# Altium project Audio-Beamformer.PrjPcb (part 1 of 2)
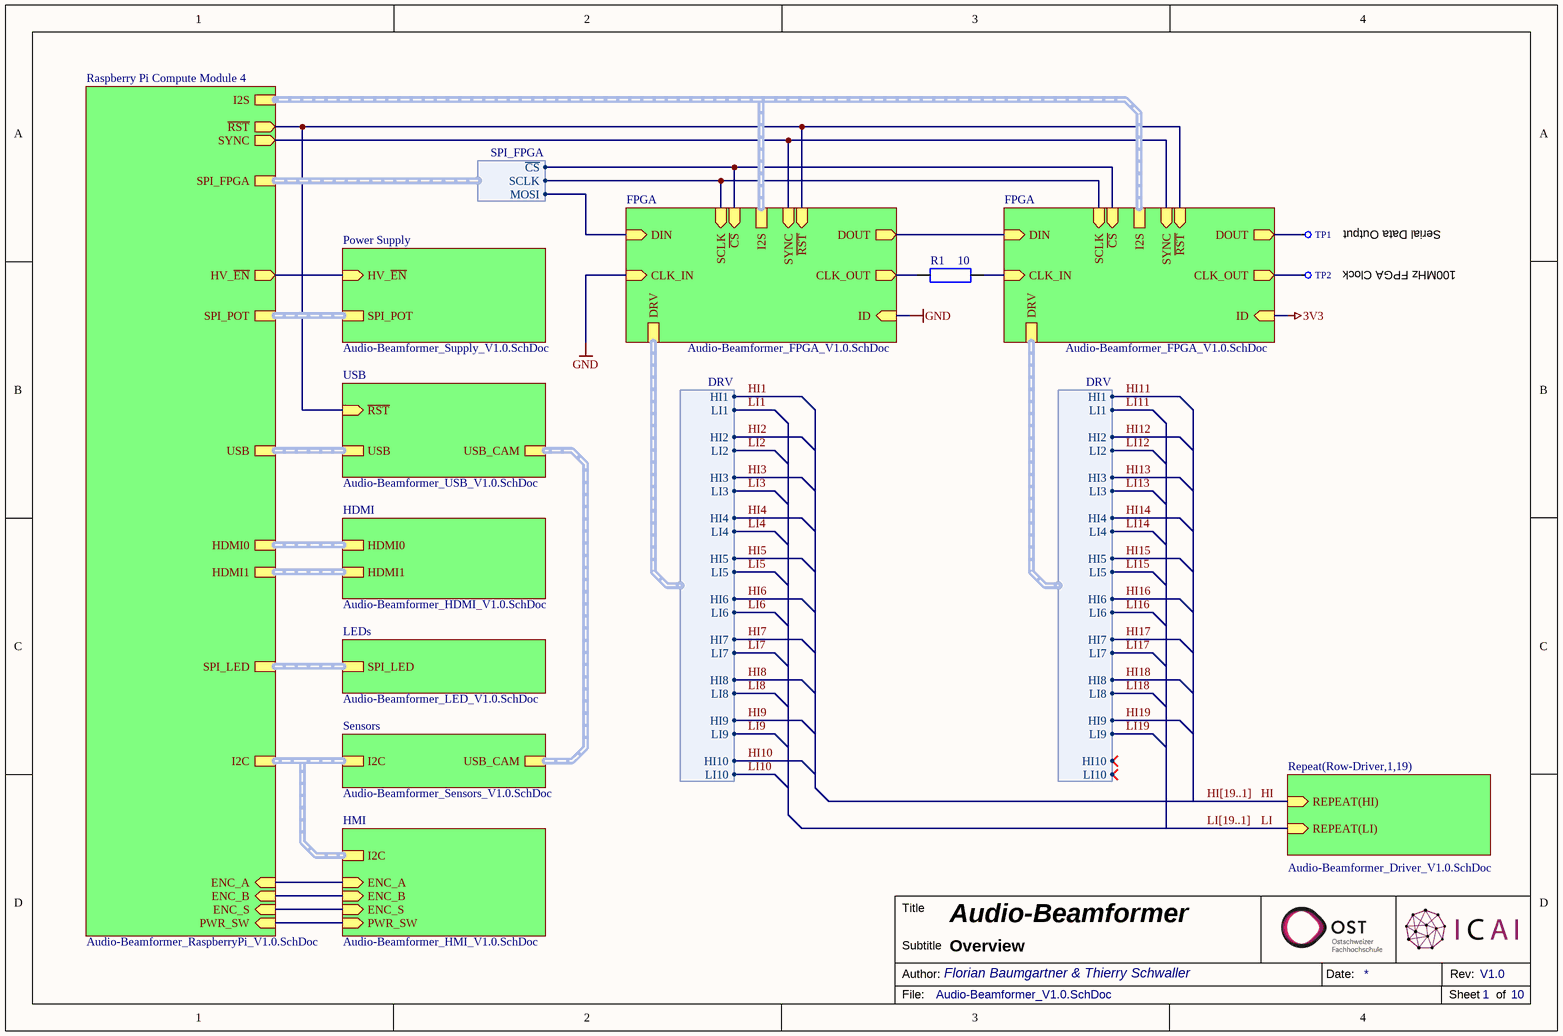
[diagram p0: Audio-Beamformer_V1.0.SchDoc]
10 sheets, 1135 parts. Net scope: hierarchical (ports join the sheet entries above them; power ports are global).
Board file: Audio-Beamformer_V1.0.PcbDoc
Sheets:
  Audio-Beamformer_V1.0.SchDoc
    Row-Driver1 = Audio-Beamformer_Driver_V1.0.SchDoc
    Row-Driver2 = Audio-Beamformer_Driver_V1.0.SchDoc
    Row-Driver3 = Audio-Beamformer_Driver_V1.0.SchDoc
    Row-Driver4 = Audio-Beamformer_Driver_V1.0.SchDoc
    Row-Driver5 = Audio-Beamformer_Driver_V1.0.SchDoc
    Row-Driver6 = Audio-Beamformer_Driver_V1.0.SchDoc
    Row-Driver7 = Audio-Beamformer_Driver_V1.0.SchDoc
    Row-Driver8 = Audio-Beamformer_Driver_V1.0.SchDoc
    Row-Driver9 = Audio-Beamformer_Driver_V1.0.SchDoc
    Row-Driver10 = Audio-Beamformer_Driver_V1.0.SchDoc
    Row-Driver11 = Audio-Beamformer_Driver_V1.0.SchDoc
    Row-Driver12 = Audio-Beamformer_Driver_V1.0.SchDoc
    Row-Driver13 = Audio-Beamformer_Driver_V1.0.SchDoc
    Row-Driver14 = Audio-Beamformer_Driver_V1.0.SchDoc
    Row-Driver15 = Audio-Beamformer_Driver_V1.0.SchDoc
    Row-Driver16 = Audio-Beamformer_Driver_V1.0.SchDoc
    Row-Driver17 = Audio-Beamformer_Driver_V1.0.SchDoc
    Row-Driver18 = Audio-Beamformer_Driver_V1.0.SchDoc
    Row-Driver19 = Audio-Beamformer_Driver_V1.0.SchDoc
    Power Supply = Audio-Beamformer_Supply_V1.0.SchDoc
    LEDs = Audio-Beamformer_LED_V1.0.SchDoc
    Raspberry Pi Compute Module 4 = Audio-Beamformer_RaspberryPi_V1.0.SchDoc
    USB = Audio-Beamformer_USB_V1.0.SchDoc
    HDMI = Audio-Beamformer_HDMI_V1.0.SchDoc
    Sensors = Audio-Beamformer_Sensors_V1.0.SchDoc
    FPGA = Audio-Beamformer_FPGA_V1.0.SchDoc
    FPGA = Audio-Beamformer_FPGA_V1.0.SchDoc
    HMI = Audio-Beamformer_HMI_V1.0.SchDoc

## Sheet Audio-Beamformer_V1.0.SchDoc: Audio-Beamformer
size A4; PageSetup: Record=PageOptions|CenterHorizontal=True|CenterVertical=True|PrintScale=0.97|XCorrection=1.00|YCorrection=1.00|PrintKind=0|BorderSize=5000000|LeftOffset=0|BottomOffset=0|Orientation=2|PaperLength=1000|PaperWidth=1000|Scale=100|PaperSource=7|PrintQuality=-3|MediaType=1|DitherType=10|PrintScaleMode=1|PaperKind=A4|PaperIndex=9; Organization: Ostschweizer Fachhochschule; Address2: Florian Baumgartner & Thierry Schwaller; Address3: florian.baumgartner@ost.ch; DocumentNumber: 1; Revision: V1.0; SheetNumber: 1; SheetTotal: 10; Author: Florian Baumgartner & Thierry Schwaller; Subtitle: Overview

### Parts
R1  10  [SMD Widerstand 0603]
TP1  X-TP  [THT Testpunkt Ø1mm]  (value not drawn)  (no BOM)
TP2  X-TP  [THT Testpunkt Ø1mm]  (value not drawn)  (no BOM)

### Sub-sheets
FPGA = Audio-Beamformer_FPGA_V1.0.SchDoc: I2S (harness I2S), CLK_OUT (out), DRV (harness DRV), ~{RST} (in), CLK_IN (in), SYNC (in), ID (in), DOUT (out), SCLK (in), ~{CS} (in), DIN (in)
FPGA = Audio-Beamformer_FPGA_V1.0.SchDoc: I2S (harness I2S), CLK_OUT (out), DRV (harness DRV), ~{RST} (in), CLK_IN (in), SYNC (in), ID (in), DOUT (out), SCLK (in), ~{CS} (in), DIN (in)
HDMI = Audio-Beamformer_HDMI_V1.0.SchDoc: HDMI1 (harness HDMI1), HDMI0 (harness HDMI0)
HMI = Audio-Beamformer_HMI_V1.0.SchDoc: ENC_B (in), ENC_S (in), PWR_SW (in), ENC_A (in), I2C (harness I2C)
LEDs = Audio-Beamformer_LED_V1.0.SchDoc: SPI_LED (harness SPI_LED)
Power Supply = Audio-Beamformer_Supply_V1.0.SchDoc: HV_~{EN} (in), SPI_POT (harness SPI_POT)
Raspberry Pi Compute Module 4 = Audio-Beamformer_RaspberryPi_V1.0.SchDoc: I2C (harness I2C), PWR_SW (in), ~{RST} (out), SPI_POT (harness SPI_POT), HDMI0 (harness HDMI0), HDMI1 (harness HDMI1), SPI_LED (harness SPI_LED), SPI_FPGA (harness SPI_FPGA), I2S (harness I2S), USB (harness USB), ENC_B (in), SYNC (out), ENC_A (in), ENC_S (in), HV_~{EN} (out)
Repeat(Row-Driver,1,19) = Audio-Beamformer_Driver_V1.0.SchDoc: REPEAT(HI) (in), REPEAT(LI) (in)
Sensors = Audio-Beamformer_Sensors_V1.0.SchDoc: I2C (harness I2C), USB_CAM (harness USB_CAM)
USB = Audio-Beamformer_USB_V1.0.SchDoc: USB_CAM (harness USB_CAM), USB (harness USB), ~{RST} (in)

### Harnesses
DRV: LI1, LI2, LI3, LI4, LI5, LI6, LI7, LI8, LI9, LI10, HI1, HI2, HI3, HI4, HI5, HI6, HI7, HI8, HI9, HI10
SPI_FPGA: SCLK, MOSI, ~{CS}

### Nets
GND: sheet FPGA/CLK_IN, sheet FPGA/ID  [project net A14]
A6: sheet FPGA/~{CS}, sheet FPGA/~{CS}, sheet Raspberry Pi Compute Module 4/SPI_FPGA.~{CS}
A8: sheet FPGA/SCLK, sheet FPGA/SCLK, sheet Raspberry Pi Compute Module 4/SPI_FPGA.SCLK
A9: sheet FPGA/DIN, sheet Raspberry Pi Compute Module 4/SPI_FPGA.MOSI
A11: TP1.1 ; sheet FPGA/DOUT
A11: sheet FPGA/DOUT, sheet FPGA/DIN  [a separate net that carries the same name]
A12: sheet Raspberry Pi Compute Module 4/SYNC, sheet FPGA/SYNC, sheet FPGA/SYNC
A14: R1.1 ; sheet FPGA/CLK_IN
D39: sheet Raspberry Pi Compute Module 4/~{RST}, sheet USB/~{RST}, sheet FPGA/~{RST}, sheet FPGA/~{RST}
D40: R1.2 ; sheet FPGA/CLK_OUT
D40: TP2.1 ; sheet FPGA/CLK_OUT  [a separate net that carries the same name]
ENC_A: sheet Raspberry Pi Compute Module 4/ENC_A, sheet HMI/ENC_A
ENC_B: sheet Raspberry Pi Compute Module 4/ENC_B, sheet HMI/ENC_B
ENC_S: sheet Raspberry Pi Compute Module 4/ENC_S, sheet HMI/ENC_S
HI: sheet Repeat(Row-Driver,1,19)/REPEAT(HI)
HV_EN: sheet Power Supply/HV_~{EN}, sheet Raspberry Pi Compute Module 4/HV_~{EN}
LI: sheet Repeat(Row-Driver,1,19)/REPEAT(LI)
PWR_SW: sheet Raspberry Pi Compute Module 4/PWR_SW, sheet HMI/PWR_SW

### Buses and harness runs
bus HI[19..1]
bus LI[19..1]
harness sheet FPGA/I2S = sheet Raspberry Pi Compute Module 4/I2S
harness sheet HDMI/HDMI0 = sheet Raspberry Pi Compute Module 4/HDMI0
harness sheet HDMI/HDMI1 = sheet Raspberry Pi Compute Module 4/HDMI1
harness sheet HMI/I2C = sheet Raspberry Pi Compute Module 4/I2C = sheet Sensors/I2C
harness sheet LEDs/SPI_LED = sheet Raspberry Pi Compute Module 4/SPI_LED
harness sheet Power Supply/SPI_POT = sheet Raspberry Pi Compute Module 4/SPI_POT
harness sheet Raspberry Pi Compute Module 4/USB = sheet USB/USB
harness sheet Sensors/USB_CAM = sheet USB/USB_CAM

### Notes on the sheet
- Serial Data Output
- 100MHz FPGA Clock
- Title
- Author:
- Subtitle
- Date:
- Rev:
- File:
- Sheet
- of

### Library data of the parts
R1 = R-RESISTOR: RES (E=Heizwiderstand B=Messwandler); Component Description: Thick Film Chip Resistor; Component Value: 10 (75V, 100mW, 1%); Digikey: P10.0HCT-ND; Farnell: 2302958; Mouser: 667-ERJ-3EKF10R0V; JLC-Parts: C22859; Unit Price: 0.01
TP1 TP2 = X-TP: Testpunkt; Component Description: Testpoint; Component Value: Ø 0.8mm; Unit Price: 0.00

## Sheet Audio-Beamformer_Driver_V1.0.SchDoc: Audio-Beamformer
size A4; PageSetup: Record=PageOptions|CenterHorizontal=True|CenterVertical=True|PrintScale=0.97|XCorrection=1.00|YCorrection=1.00|PrintKind=0|BorderSize=5000000|LeftOffset=0|BottomOffset=0|Orientation=2|PaperLength=1000|PaperWidth=1000|Scale=100|PaperSource=7|PrintQuality=-3|MediaType=1|DitherType=10|PrintScaleMode=1|PaperKind=A4|PaperIndex=9; Organization: Ostschweizer Fachhochschule; Address2: Florian Baumgartner & Thierry Schwaller; Address3: florian.baumgartner@ost.ch; DocumentNumber: 5; Revision: V1.0; SheetNumber: 5; SheetTotal: 10; Author: Florian Baumgartner & Thierry Schwaller; Subtitle: H-Bridge Driver
Used 19 times, as channels Row-Driver1, Row-Driver2, Row-Driver3, Row-Driver4, Row-Driver5, Row-Driver6, Row-Driver7, Row-Driver8, Row-Driver9, Row-Driver10, Row-Driver11, Row-Driver12, Row-Driver13, Row-Driver14, Row-Driver15, Row-Driver16, Row-Driver17, Row-Driver18, Row-Driver19. Parts and nets are listed once, with the designators drawn on the sheet.
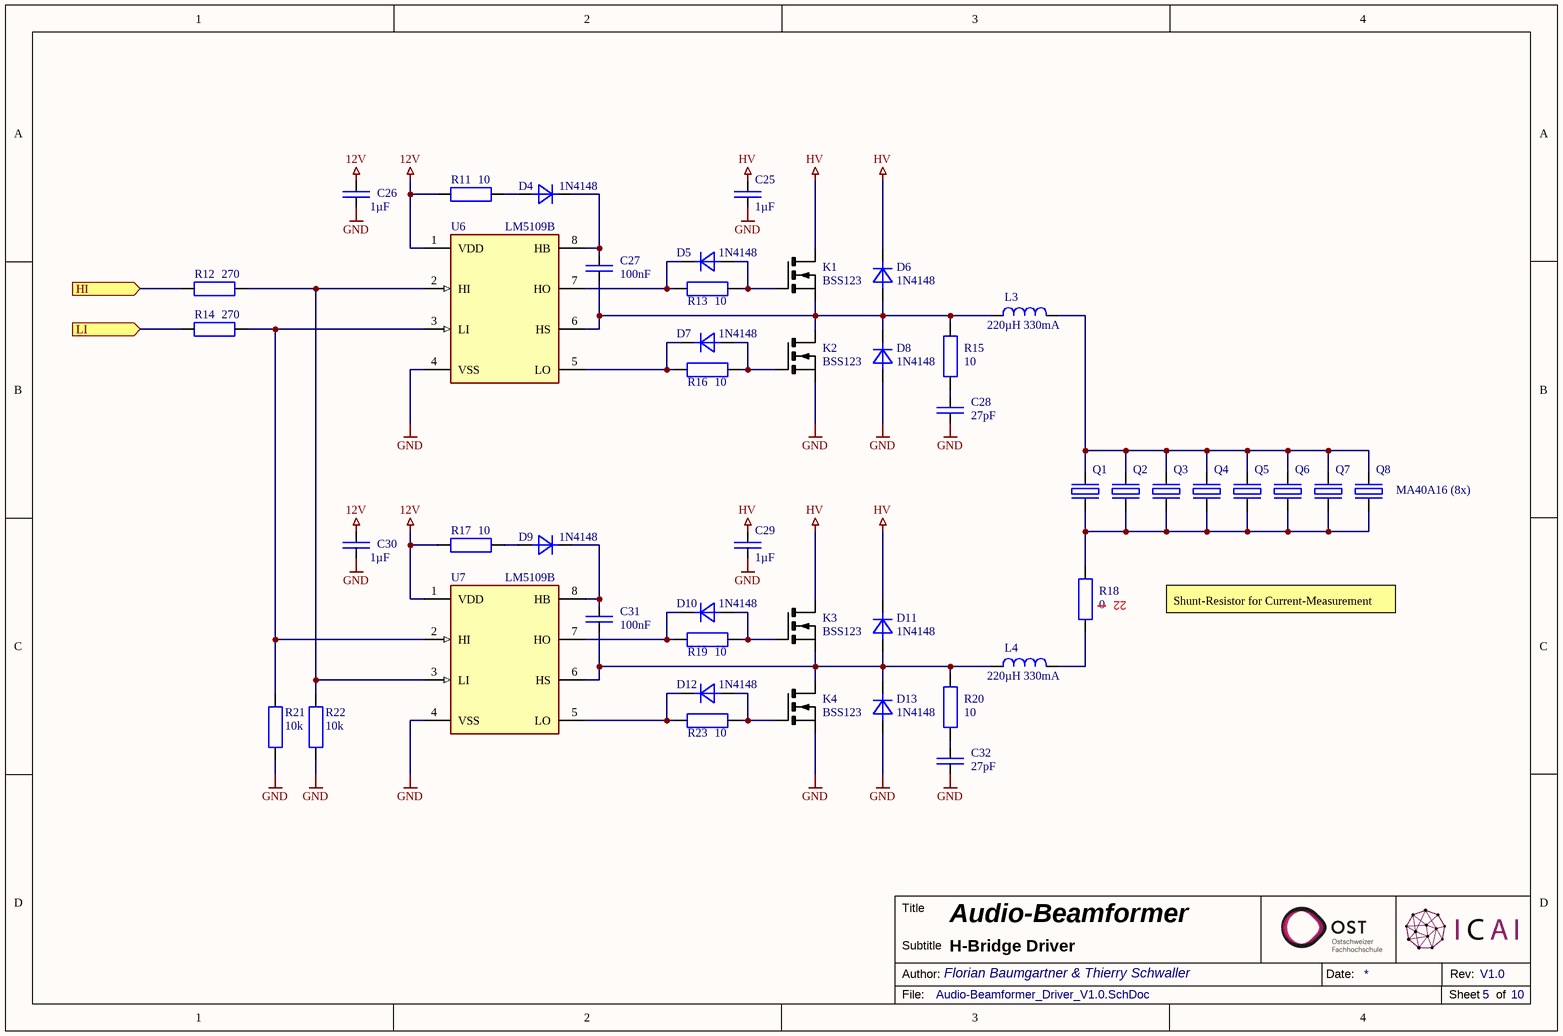
[diagram p1: Audio-Beamformer_Driver_V1.0.SchDoc]

### Parts
C25  1µF  [SMD Keramikkondensator 1206]
C26  1µF  [SMD Keramikkondensator 0603]
C27  100nF  [SMD Keramikkondensator 0603]
C28  27pF  [SMD Keramikkondensator 0603]
C29  1µF  [SMD Keramikkondensator 1206]
C30  1µF  [SMD Keramikkondensator 0603]
C31  100nF  [SMD Keramikkondensator 0603]
C32  27pF  [SMD Keramikkondensator 0603]
D4  1N4148  [SMD Diode SOD-123]
D5  1N4148  [SMD Diode SOD-123]
D6  1N4148  [SMD Diode SOD-123]
D7  1N4148  [SMD Diode SOD-123]
D8  1N4148  [SMD Diode SOD-123]
D9  1N4148  [SMD Diode SOD-123]
D10  1N4148  [SMD Diode SOD-123]
D11  1N4148  [SMD Diode SOD-123]
D12  1N4148  [SMD Diode SOD-123]
D13  1N4148  [SMD Diode SOD-123]
K1  BSS123  [SMD MOSFET SOT-23]
K2  BSS123  [SMD MOSFET SOT-23]
K3  BSS123  [SMD MOSFET SOT-23]
K4  BSS123  [SMD MOSFET SOT-23]
L3  220µH 330mA  [SMD Inductor 7x7x4.5]
L4  220µH 330mA  [SMD Inductor 7x7x4.5]
Q1  MA40A16  [THT Transducer (MA40A16) (5mm Offset)]  (value not drawn)
Q2  MA40A16  [THT Transducer (MA40A16) (5mm Offset)]  (value not drawn)
Q3  MA40A16  [THT Transducer (MA40A16) (5mm Offset)]  (value not drawn)
Q4  MA40A16  [THT Transducer (MA40A16) (5mm Offset)]  (value not drawn)
Q5  MA40A16  [THT Transducer (MA40A16) (5mm Offset)]  (value not drawn)
Q6  MA40A16  [THT Transducer (MA40A16) (5mm Offset)]  (value not drawn)
Q7  MA40A16  [THT Transducer (MA40A16) (5mm Offset)]  (value not drawn)
Q8  MA40A16  [THT Transducer (MA40A16) (5mm Offset)]  (value not drawn)
R11  10  [SMD Widerstand 0603]
R12  270  [SMD Widerstand 0603]
R13  10  [SMD Widerstand 0603]
R14  270  [SMD Widerstand 0603]
R15  10  [SMD Widerstand 1206]
R16  10  [SMD Widerstand 0603]
R17  10  [SMD Widerstand 0603]
R18  0  [SMD Widerstand 1206]
R19  10  [SMD Widerstand 0603]
R20  10  [SMD Widerstand 1206]
R21  10k  [SMD Widerstand 0603]
R22  10k  [SMD Widerstand 0603]
R23  10  [SMD Widerstand 0603]
U6  LM5109B  [SMD IC SOIC-8]
U7  LM5109B  [SMD IC SOIC-8]

### Ports
HI (in), LI (in)

### Nets
12V: C26.2 C30.2 R11.2 R17.2 U6.1(VDD) U7.1(VDD)
GND: C25.1 C26.1 C28.2 C29.1 C30.1 C32.2 D8.A D13.A K2.S K4.S R21.1 R22.1 U6.4(VSS) U7.4(VSS)
HV: C25.2 C29.2 D6.K D11.K K1.D K3.D
HI: R12.1 ; port HI
LI: R14.1 ; port LI
NetC27_1: C27.1 D6.A D8.K K1.S K2.D L3.1 R15.2 U6.6(HS)
NetC27_2: C27.2 D4.K U6.8(HB)
NetC28_1: C28.1 R15.1
NetC31_1: C31.1 D11.A D13.K K3.S K4.D L4.1 R20.2 U7.6(HS)
NetC31_2: C31.2 D9.K U7.8(HB)
NetC32_1: C32.1 R20.1
NetD4_A: D4.A R11.1
NetD5_A: D5.A K1.G R13.1
NetD5_K: D5.K R13.2 U6.7(HO)
NetD7_A: D7.A K2.G R16.1
NetD7_K: D7.K R16.2 U6.5(LO)
NetD9_A: D9.A R17.1
NetD10_A: D10.A K3.G R19.1
NetD10_K: D10.K R19.2 U7.7(HO)
NetD12_A: D12.A K4.G R23.1
NetD12_K: D12.K R23.2 U7.5(LO)
NetL3_2: L3.2 Q1.2 Q2.2 Q3.2 Q4.2 Q5.2 Q6.2 Q7.2 Q8.2
NetL4_2: L4.2 R18.1
NetQ1_1: Q1.1 Q2.1 Q3.1 Q4.1 Q5.1 Q6.1 Q7.1 Q8.1 R18.2
NetR12_2: R12.2 R22.2 U6.2(HI) U7.3(LI)
NetR14_2: R14.2 R21.2 U6.3(LI) U7.2(HI)

### Channels
Row-Driver1: designators end in _1; ports HI=B49 LI=B48
Row-Driver2: designators end in _2; ports HI=B46 LI=B45
Row-Driver3: designators end in _3; ports HI=B43 LI=B42
Row-Driver4: designators end in _4; ports HI=B40 LI=B39
Row-Driver5: designators end in _5; ports HI=B37 LI=B36
Row-Driver6: designators end in _6; ports HI=B34 LI=B33
Row-Driver7: designators end in _7; ports HI=B31 LI=B30
Row-Driver8: designators end in _8; ports HI=B28 LI=B27
Row-Driver9: designators end in _9; ports HI=B24 LI=B23
Row-Driver10: designators end in _10; ports HI=B21 LI=B20
Row-Driver11: designators end in _11; ports HI=B49 LI=B48
Row-Driver12: designators end in _12; ports HI=B46 LI=B45
Row-Driver13: designators end in _13; ports HI=B43 LI=B42
Row-Driver14: designators end in _14; ports HI=B40 LI=B39
Row-Driver15: designators end in _15; ports HI=B37 LI=B36
Row-Driver16: designators end in _16; ports HI=B34 LI=B33
Row-Driver17: designators end in _17; ports HI=B31 LI=B30
Row-Driver18: designators end in _18; ports HI=B28 LI=B27
Row-Driver19: designators end in _19; ports HI=B24 LI=B23

### Notes on the sheet
- (near Q8) MA40A16 (8x)
- (near R18) 22
- Shunt-Resistor for Current-Measurement
- Title
- Author:
- Subtitle
- Date:
- Rev:
- File:
- Sheet
- of

### Library data of the parts
C25 C29 = C-CAPACITOR: CAP-MK; Component Description: Multilayer Ceramic Capacitors; Component Value: 1µF 100V; Digikey: 720-VJ1206Y104MXBATCT-ND; Farnell: 1657939; Mouser: 77-VJ1206Y104MXBAT; JLC-Parts: C91151; Unit Price: 0.01
C26 C30 = C-CAPACITOR: CAP-MK; Component Description: Multilayer Ceramic Capacitors; Component Value: 1µF 50V; Digikey: 1276-1860-1-ND; Farnell: 3013383; Mouser: 187-CL10A105KB8NNNC; JLC-Parts: C15849; Unit Price: 0.01
C27 C31 = C-CAPACITOR: CAP-MK; Component Description: Multilayer Ceramic Capacitors; Component Value: 100nF 50V; Digikey: 445-5666-1-ND; Farnell: 2522432; Mouser: 77-VJ0603V104ZXAPBC; JLC-Parts: C14663; Unit Price: 0.01
C28 C32 = C-CAPACITOR: CAP-MK; Component Description: Multilayer Ceramic Capacitors; Component Value: 27pF 50V; Digikey: 399-C0603C270J5GAC7867CT-ND; Farnell: 1414627; Mouser: 80-C0603C270J5G; JLC-Parts: C1656; Unit Price: 0.01
D4-D13 = R-DIODE: DIODE (alt V); Component Description: Fast Switching Diode; Component Value: 1N4148WTR; Digikey: 1655-1360-1-ND; Farnell: 2306363; Mouser: 750-1N4148W-HF; ComponentLink1Description: Datasheet; ComponentLink1URL: https://datasheet.lcsc.com/lcsc/1811061725_ST-Semtech-1N4148W_C81598.pdf; JLC-Parts: C81598; Unit Price: 0.01
K1-K4 = K-FET:NIGE: MOSFET N-Channel; Digikey: 3191-BSS123-F2-0000HFCT-ND; Farnell: 3755132; Mouser: 726-BSS123NH6433; Component Description: MOSFET N-Channel; ComponentLink1Description: Datasheet; ComponentLink1URL: https://datasheet.lcsc.com/lcsc/1912111437_BORN-BSS123_C431506.pdf; Component Value: BSS123; JLC-Parts: C431506; Unit Price: 0.02
L3 L4 = L-COIL: Shielded Power Inductor; Component Value: SLF7045T-221MR33-PF (220µH 330mA); ComponentLink1Description: Datasheet; ComponentLink1URL: https://datasheet.lcsc.com/lcsc/1810010112_TDK-SLF7045T-221MR33-PF_C24679.pdf; Digikey: 445-1210-1-ND; Farnell: 2215715; JLC-Parts: C24679; Mouser: 810-SLF7045T-221M; Component Description: Shielded Power Inductor; Unit Price: 0.32
Q1-Q8 = Q-Piezo: Ultrasonic Transducer; Component Value: MA40A16 (40kHz, 16mm); Component Description: Ultrasonic Transducer; Unit Price: 0.40
R11 R13 R16 R17 R19 R23 = R-RESISTOR: as R1 on sheet Audio-Beamformer_V1.0; Digikey: P10.0HCT-ND; Farnell: 2302958; Mouser: 667-ERJ-3EKF10R0V; JLC-Parts: C22859; Unit Price: 0.01
R12 R14 = R-RESISTOR: SMD-Widerstand 1/4W; Component Description: Thick Film Chip Resistor; Component Value: 270 (75V, 100mW, 1%); Digikey: P270HCT-ND; Farnell: 2303096; Mouser: 667-ERJ-3EKF2700V; JLC-Parts: C22966; Unit Price: 0.06
R15 R20 = R-RESISTOR: RES (E=Heizwiderstand B=Messwandler); Component Description: Thick Film Chip Resistor; Component Value: 10 (200V, 250mW, 1%); Digikey: P10ECT-ND; Farnell: 2057799; Mouser: 667-ERJ-8GEYJ100V; JLC-Parts: C17903; Unit Price: 0.01
R18 = R-RESISTOR: RES (E=Heizwiderstand B=Messwandler); Component Description: Thick Film Chip Resistor; Component Value: 0 (200V, 250mW, 1%); Digikey: P0.0ECT-ND; Farnell: 2057791; Mouser: 667-ERJ-8GEY0R00V; JLC-Parts: C17888; Unit Price: 0.01
R21 R22 = R-RESISTOR: RES (E=Heizwiderstand B=Messwandler); Component Description: Thick Film Chip Resistor; Component Value: 10k (75V, 100mW, 1%); Digikey: P10.0KHCT-ND; Farnell: 2303192; Mouser: 667-ERJ-3EKF1002V; JLC-Parts: C25804; Unit Price: 0.01
U6 U7 = U-LM5109B: High Voltage 1A Peak Half Bridge Gate Driver; Component Description: High Voltage Gate Driver; ComponentLink1Description: Datasheet; ComponentLink1URL: https://datasheet.lcsc.com/lcsc/1809172040_Texas-Instruments-LM5109AMAX-NOPB_C129332.pdf; Digikey: LM5109BMA/NOPB-ND; Component Value: LM5109B; Farnell: 3005776; JLC-Parts: C116862; Mouser: 926-LM5109BMAX/NOPB; Unit Price: 1.13

## Sheet Audio-Beamformer_Supply_V1.0.SchDoc: Audio-Beamformer
size A4; PageSetup: Record=PageOptions|CenterHorizontal=True|CenterVertical=True|PrintScale=0.97|XCorrection=1.00|YCorrection=1.00|PrintKind=0|BorderSize=5000000|LeftOffset=0|BottomOffset=0|Orientation=2|PaperLength=1000|PaperWidth=1000|Scale=100|PaperSource=7|PrintQuality=-3|MediaType=1|DitherType=10|PrintScaleMode=1|PaperKind=A4|PaperIndex=9; Organization: Ostschweizer Fachhochschule; Address2: Florian Baumgartner & Thierry Schwaller; Address3: florian.baumgartner@ost.ch; DocumentNumber: 2; Revision: V1.0; SheetNumber: 2; SheetTotal: 10; Author: Florian Baumgartner & Thierry Schwaller; Subtitle: Power Supply
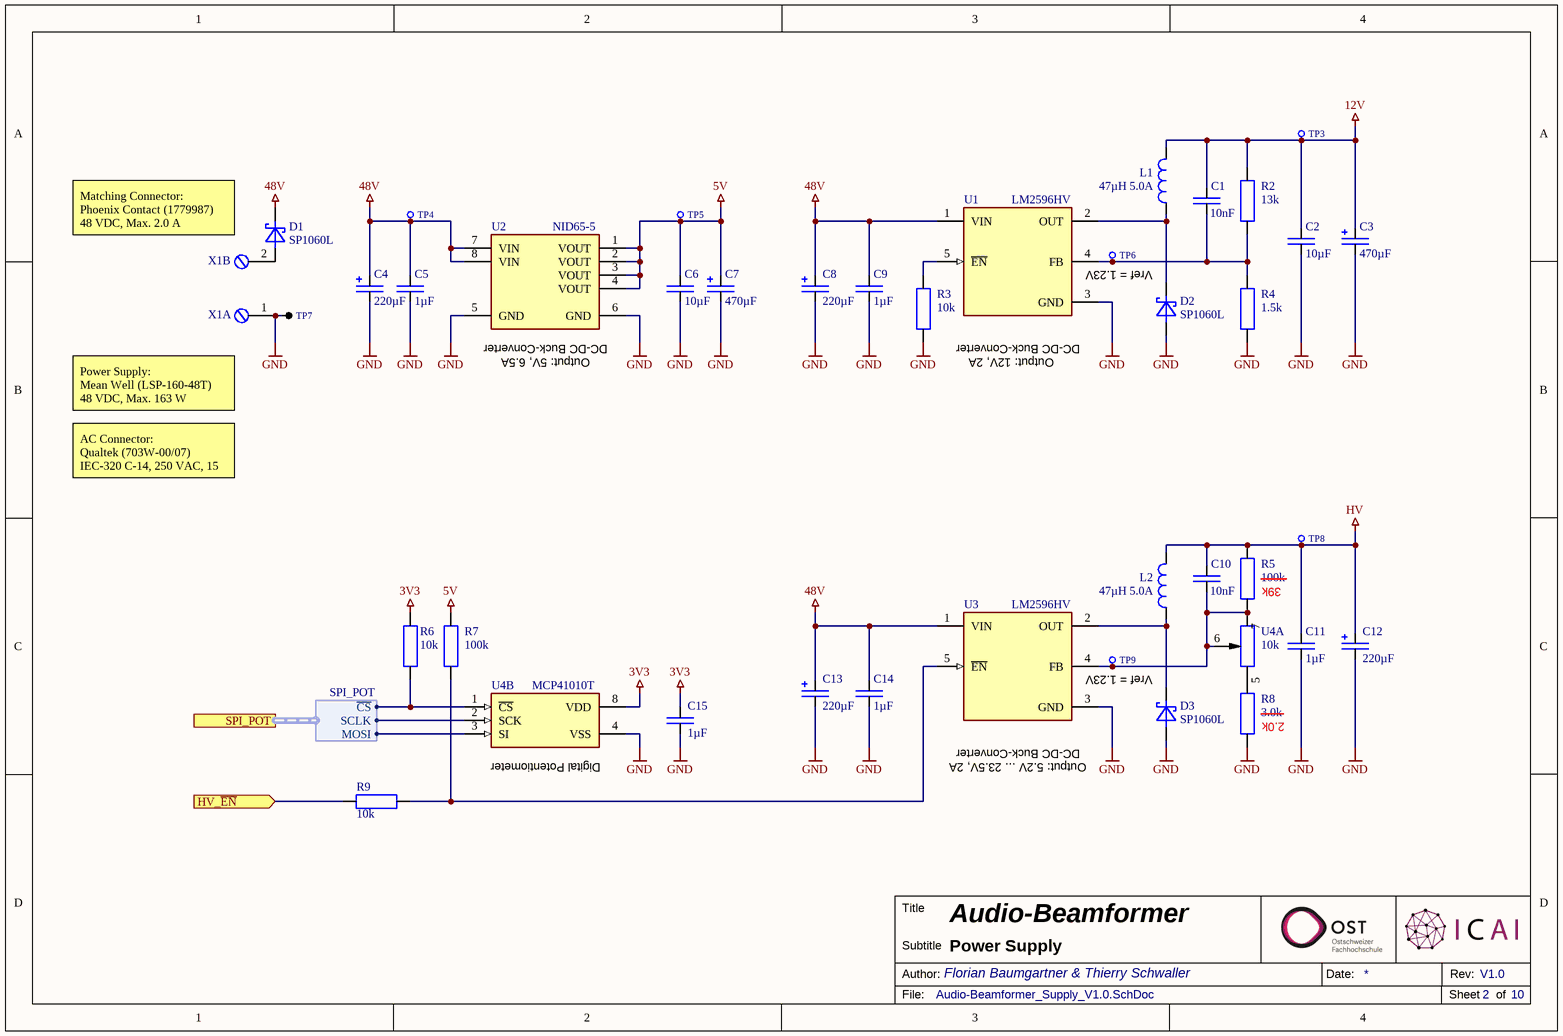
[diagram p2: Audio-Beamformer_Supply_V1.0.SchDoc]

### Parts
C1  10nF  [SMD Keramikkondensator 0603]
C2  10µF  [SMD Keramikkondensator 1206]
C3  470µF  [SMD Elko 10.0x10.0]
C4  220µF  [SMD Elko 12.5x13.5]
C5  1µF  [SMD Keramikkondensator 1206]
C6  10µF  [SMD Keramikkondensator 1206]
C7  470µF  [SMD Elko 10.0x10.0]
C8  220µF  [SMD Elko 12.5x13.5]
C9  1µF  [SMD Keramikkondensator 1206]
C10  10nF  [SMD Keramikkondensator 0603]
C11  1µF  [SMD Keramikkondensator 1206]
C12  220µF  [SMD Elko 12.5x13.5]
C13  220µF  [SMD Elko 12.5x13.5]
C14  1µF  [SMD Keramikkondensator 1206]
C15  1µF  [SMD Keramikkondensator 0603]
D1  SP1060L  [SMD Diode TO-277]
D2  SP1060L  [SMD Diode TO-277]
D3  SP1060L  [SMD Diode TO-277]
L1  47µH 5.0A  [SMD Inductor 13.8x12.6x6.5]
L2  47µH 5.0A  [SMD Inductor 13.8x12.6x6.5]
R2  13k  [SMD Widerstand 0603]
R3  10k  [SMD Widerstand 0603]
R4  1.5k  [SMD Widerstand 0603]
R5  100k  [SMD Widerstand 0603]
R6  10k  [SMD Widerstand 0603]
R7  100k  [SMD Widerstand 0603]
R8  3.0k  [SMD Widerstand 0603]
R9  10k  [SMD Widerstand 0603]
TP3  X-TP  [THT Testpunkt Ø1mm]  (value not drawn)  (no BOM)
TP4  X-TP  [THT Testpunkt Ø1mm]  (value not drawn)  (no BOM)
TP5  X-TP  [THT Testpunkt Ø1mm]  (value not drawn)  (no BOM)
TP6  X-TP  [THT Testpunkt Ø1mm]  (value not drawn)  (no BOM)
TP7  Schwarz  [THT Messpunkt Ø2.54mm Schwarz]  (value not drawn)
TP8  X-TP  [THT Testpunkt Ø1mm]  (value not drawn)  (no BOM)
TP9  X-TP  [THT Testpunkt Ø1mm]  (value not drawn)  (no BOM)
U1  LM2596HV  [SMD IC TO-263-5]
U2  NID65-5  [THT DC-DC-Converter (NID65-X)]
U3  LM2596HV  [SMD IC TO-263-5]
U4  MCP41010T  [SMD IC SOIC-8]  (value not drawn)  (parts A,B of 2)
X1  X-Klemme (2-Pol)  [THT Schraubklemme Steckbar 2-Pol (1757242)]  (value not drawn)  (parts A,B of 2)

### Ports
HV_~{EN} (in), SPI_POT (harness SPI_POT)

### Harnesses
SPI_POT: SCLK, MOSI, ~{CS}

### Nets
3V3: C15.2 R6.2 U4.8(NC)  [project net A17]
5V: C6.2 C7.P(+) R7.2 TP5.1 U2.1(VOUT) U2.2(VOUT) U2.3(VOUT) U2.4(VOUT)
12V: C1.2 C2.2 C3.P(+) L1.1 R2.2 TP3.1
48V: C4.P(+) C5.2 C8.P(+) C9.2 C13.P(+) C14.2 D1.K TP4.1 U1.1(VIN) U2.7(VIN) U2.8(VIN) U3.1(VIN)
GND: C2.1 C3.M(-) C4.M(-) C5.1 C6.1 C7.M(-) C8.M(-) C9.1 C11.1 C12.M(-) C13.M(-) C14.1 C15.1 D2.A D3.A R3.1 R4.2 R8.2 TP7.1 U1.3(GND) U2.5(GND) U2.6(GND) U3.3(GND) U4.4(VSS) X1.1  [project net A14]
HV: C10.2 C11.2 C12.P(+) L2.1 R5.2 TP8.1
HV_EN: R9.2 ; port HV_~{EN}
SPI4_CE1: R6.1 U4.1(~{CS}) ; port SPI_POT.~{CS}
SPI4_MOSI: U4.3(SI) ; port SPI_POT.MOSI
SPI4_SCLK: U4.2(SCK) ; port SPI_POT.SCLK
NetC1_1: C1.1 R2.1 R4.1 TP6.1 U1.4(FB)
NetC10_1: C10.1 R5.1 TP9.1 U3.4(FB) U4.6(M) U4.7(NC)
NetD1_A: D1.A X1.2
NetD2_K: D2.K L1.2 U1.2(OUT)
NetD3_K: D3.K L2.2 U3.2(OUT)
NetR3_2: R3.2 U1.5(~{EN})
NetR7_1: R7.1 R9.1 U3.5(~{EN})
NetR8_1: R8.1 U4.5(H)

Not connected (* = marked no-connect by the designer): U2 9(NC) 10(NC) 11(NC); U4 9(NC) 12(NC) 13(NC)

### Notes on the sheet
- Matching Connector:
  Phoenix Contact (1779987)
  48 VDC, Max. 2.0 A
- Vref = 1.23V
- (near U2) DC-DC Buck-Converter
- (near U2) Output: 5V, 6.5A
- Output: 12V, 2A
- DC-DC Buck-Converter
- Power Supply:
  Mean Well (LSP-160-48T)
  48 VDC, Max. 163 W
- AC Connector:
  Qualtek (703W-00/07)
  IEC-320 C-14, 250 VAC, 15 A
- 10k
- (near R5) 39k
- (near U4) Digital Potentiometer
- (near U3) DC-DC Buck-Converter
- Output: 5.2V ... 23.5V, 2A
- (near R8) 2.0k
- Title
- Author:
- Subtitle
- Date:
- Rev:
- File:
- Sheet
- of

### Library data of the parts
C1 C10 = E6 - 10nF: SMD Ceramic Capacitor E6; Component Value: 10nF 50V; Component Description: Multilayer Ceramic Capacitors MLCC; ComponentLink1Description: Datasheet; ComponentLink1URL: https://datasheet.lcsc.com/lcsc/2102081402_FH-Guangdong-Fenghua-Advanced-Tech-0603B103K500NT_C57112.pdf; Digikey: 478-3700-1-ND; Farnell: 1833876; JLC-Parts: C57112; Mouser: 581-06031C103J; Unit Price: 0.01
C2 C6 = C-CAPACITOR: CAP-MK; Component Description: Multilayer Ceramic Capacitors; Component Value: 10µF 50V; Digikey: 445-7886-1-ND; Farnell: 2211092; Mouser: 810-CGA5L3X5R1H106K; JLC-Parts: C13585; Unit Price: 0.27
C3 C7 = C-ELCAP: CAP-Elko; Component Description: Electrolytic Capacitor; Component Value: 470µF 25V; Mouser: 140-VEJ471M1ETR1010; JLC-Parts: C176672; Unit Price: 0.17
C4 C8 C12 C13 = C-ELCAP: CAP-Elko; Component Description: Electrolytic Capacitor; Component Value: 220µF 63V; JLC-Parts: C249502; Unit Price: 0.42
C5 C9 C11 C14 = C-CAPACITOR: as C25 on sheet Audio-Beamformer_Driver_V1.0; Digikey: 720-VJ1206Y104MXBATCT-ND; Farnell: 1657939; Mouser: 77-VJ1206Y104MXBAT; JLC-Parts: C91151; Unit Price: 0.01
C15 = E6 - 1uF: SMD Ceramic Capacitor E6; Component Value: 1µF 50V; Component Description: Multilayer Ceramic Capacitors MLCC; ComponentLink1Description: Datasheet; ComponentLink1URL: https://datasheet.lcsc.com/lcsc/1810261812_Samsung-Electro-Mechanics-CL10A105KB8NNNC_C15849.pdf; Digikey: 1276-1860-1-ND; Farnell: 3013383; JLC-Parts: C15849; Mouser: 187-CL10A105KB8NNNC; Unit Price: 0.01
D1-D3 = R-DIODE:SCHKY: S-DIODE; Component Description: Low Voltage Schottky-Diode; JLC-Parts: C2693399; ComponentLink1Description: Datasheet; ComponentLink1URL: https://datasheet.lcsc.com/lcsc/2103051837_Changjiang-Electronics-Tech--CJ-SP1060L_C2693399.pdf; Component Value: SP1060L; Unit Price: 0.32
L1 L2 = L-COIL: Shielded Power Inductor; ComponentLink1Description: Datasheet; ComponentLink1URL: https://datasheet.lcsc.com/lcsc/2003172239_YJYCOIN-YSPI1365-470M_C497913.pdf; Digikey: 118-SRP1265WA-470MCT-ND; Farnell: 3929029; JLC-Parts: C497913; Mouser: 652-SRP1265WA-470M; Component Description: Shielded Power Inductor; Component Value: 47µH 5.0A; Unit Price: 0.68
R2 = R-RESISTOR: RES (E=Heizwiderstand B=Messwandler); Component Description: Thick Film Chip Resistor; Component Value: 13k (75V, 100mW, 1%); Digikey: P13.0KHCT-ND; Farnell: 2059416; Mouser: 667-ERJ-3EKF1302V; JLC-Parts: C22797; Unit Price: 0.01
R3 R6 R9 = R-RESISTOR: as R21 on sheet Audio-Beamformer_Driver_V1.0; Digikey: P10.0KHCT-ND; Farnell: 2303192; Mouser: 667-ERJ-3EKF1002V; JLC-Parts: C25804; Unit Price: 0.01
R4 = R-RESISTOR: RES (E=Heizwiderstand B=Messwandler); Component Description: Thick Film Chip Resistor; Component Value: 1.5k (75V, 100mW, 1%); Digikey: P1.50KHCT-ND; Farnell: 2303156; Mouser: 667-ERJ-3EKF1501V; JLC-Parts: C22843; Unit Price: 0.01
R5 R7 = R-RESISTOR: RES (E=Heizwiderstand B=Messwandler); Component Description: Thick Film Chip Resistor; Component Value: 100k (75V, 100mW, 1%); Digikey: P100KHCT-ND; Farnell: 2303232; Mouser: 667-ERJ-3EKF1003V; JLC-Parts: C25803; Unit Price: 0.01
R8 = R-RESISTOR: RES (E=Heizwiderstand B=Messwandler); Component Description: Thick Film Chip Resistor; Component Value: 3.0k (75V, 100mW, 1%); Digikey: P3.00KHCT-ND; Farnell: 2059357; Mouser: 667-ERJ-3EKF3001V; JLC-Parts: C4211; Unit Price: 0.01
TP3-TP6 TP8 TP9 = X-TP: as TP1 on sheet Audio-Beamformer_V1.0; Unit Price: 0.00
TP7 = X-MP: Messpunkt; Component Description: Ground-Clip; Component Value: Ø 2.54mm (Black); Digikey: 36-5001-ND; Farnell: 2301278; Mouser: 534-5001; Unit Price: 0.36
U1 U3 = U-LM2596HV: High Power Switching Buck Converter; Component Value: LM2596HVS-ADJ/TR; ComponentLink1Description: Datasheet; ComponentLink1URL: https://datasheet.lcsc.com/lcsc/2006151006_HTC-Korea-TAEJIN-Tech-LM2596HVGR-ADJ_C508705.pdf; JLC-Parts: C356713; Unit Price: 1.71; Component Description: High Power Switching Buck Converter
U2 = U-NID65-5: High Power Switching Buck Converter; ComponentLink1Description: Datasheet; ComponentLink1URL: https://www.meanwellusa.com/webapp/product/search.aspx?prod=NID65#1; Digikey: NID65-5-ND; Component Value: NID65-5; Farnell: 3253319; Mouser: 709-NID65-5; Unit Price: 16.40; Component Description: High Power Switching Buck Converter
U4 = U-MCP41010T: Component Description: Digital-Potentiometer 8-Bit; Component Value: MCP41010T-I/SN (10k); ComponentLink1Description: Datasheet; ComponentLink1URL: https://datasheet.lcsc.com/lcsc/1806121747_Microchip-Tech-MCP41010T-I-SN_C136395.pdf; Digikey: MCP41010T-I/SNCT-ND; Farnell: 2857765; JLC-Parts: C136395; Mouser: 579-MCP41010T-I/SN; Unit Price: 2.70
X1 = X-Klemme (2-Pol): Component Description: Screw Terminal (Pluggable); Component Value: 1757242 (2-Pol, 320V, 12A, 5.08mm); Digikey: 277-1106-ND; Farnell: 3705171; Mouser: 651-1757242; ComponentLink1Description: Datasheet; ComponentLink1URL: https://www.mouser.ch/datasheet/2/324/4/1757242-1440624.pdf; Unit Price: 0.66

## Sheet Audio-Beamformer_LED_V1.0.SchDoc: Audio-Beamformer
size A4; PageSetup: Record=PageOptions|CenterHorizontal=True|CenterVertical=True|PrintScale=0.97|XCorrection=1.00|YCorrection=1.00|PrintKind=0|BorderSize=5000000|LeftOffset=0|BottomOffset=0|Orientation=2|PaperLength=1000|PaperWidth=1000|Scale=100|PaperSource=7|PrintQuality=-3|MediaType=1|DitherType=10|PrintScaleMode=1|PaperKind=A4|PaperIndex=9; Organization: Ostschweizer Fachhochschule; Address2: Florian Baumgartner & Thierry Schwaller; Address3: florian.baumgartner@ost.ch; DocumentNumber: 9; Revision: V1.0; SheetNumber: 9; SheetTotal: 10; Author: Florian Baumgartner & Thierry Schwaller; Subtitle: LEDs
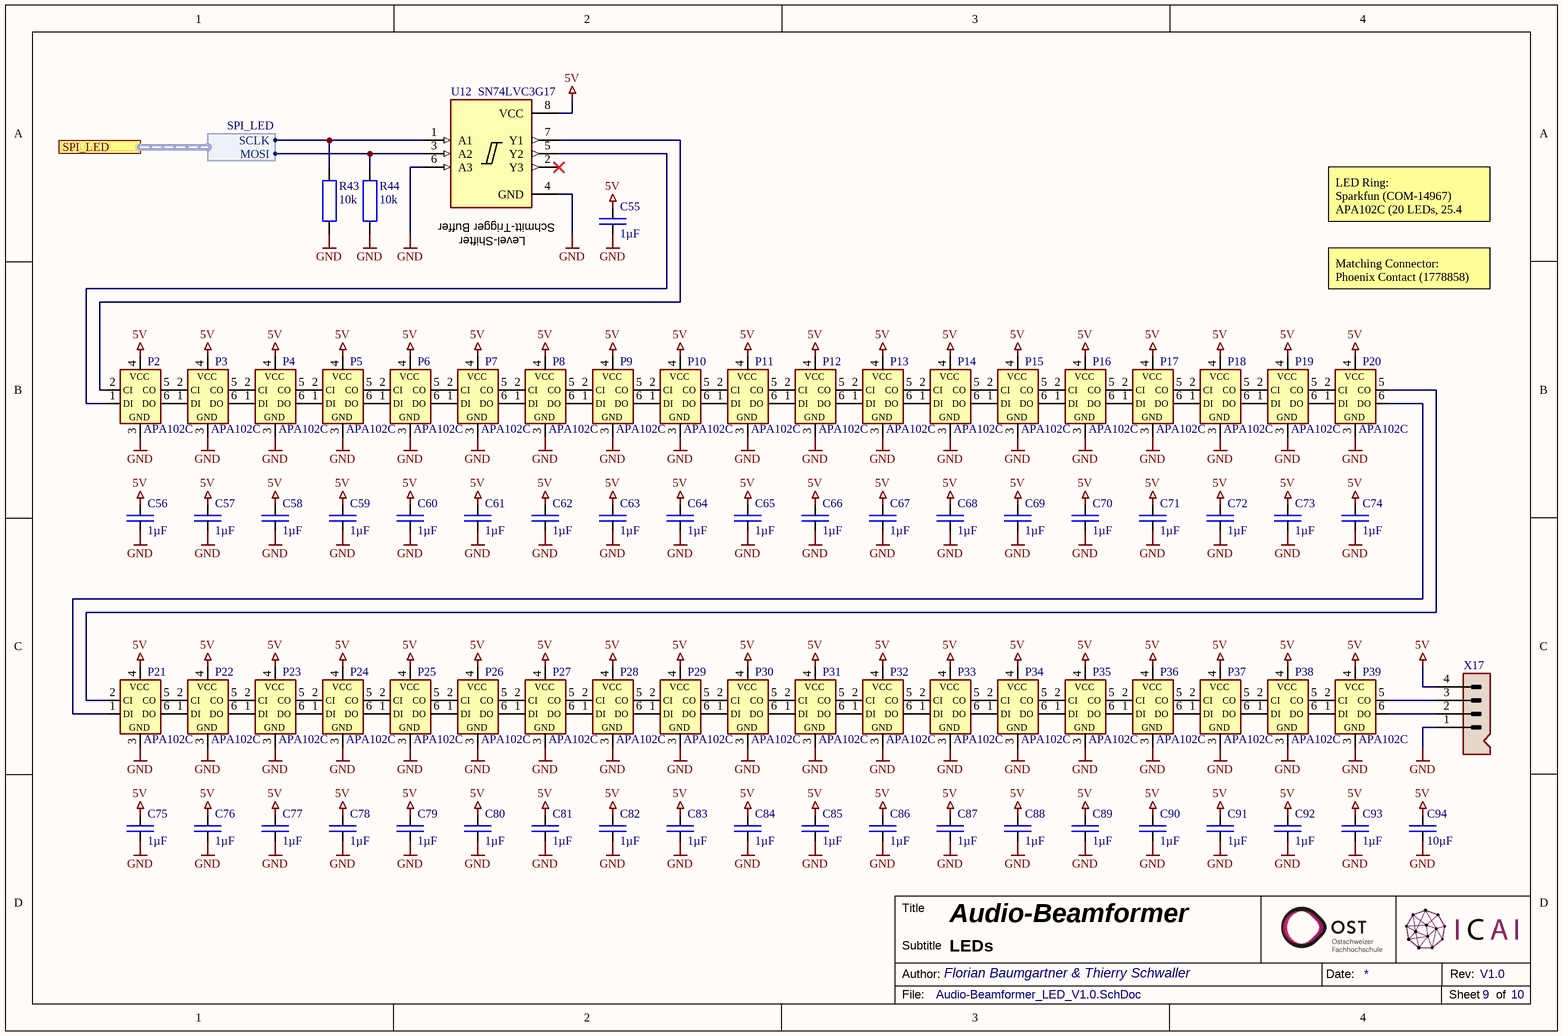
[diagram p3: Audio-Beamformer_LED_V1.0.SchDoc]

### Parts
C55  1µF  [SMD Keramikkondensator 0603]
C56  1µF  [SMD Keramikkondensator 0603]
C57  1µF  [SMD Keramikkondensator 0603]
C58  1µF  [SMD Keramikkondensator 0603]
C59  1µF  [SMD Keramikkondensator 0603]
C60  1µF  [SMD Keramikkondensator 0603]
C61  1µF  [SMD Keramikkondensator 0603]
C62  1µF  [SMD Keramikkondensator 0603]
C63  1µF  [SMD Keramikkondensator 0603]
C64  1µF  [SMD Keramikkondensator 0603]
C65  1µF  [SMD Keramikkondensator 0603]
C66  1µF  [SMD Keramikkondensator 0603]
C67  1µF  [SMD Keramikkondensator 0603]
C68  1µF  [SMD Keramikkondensator 0603]
C69  1µF  [SMD Keramikkondensator 0603]
C70  1µF  [SMD Keramikkondensator 0603]
C71  1µF  [SMD Keramikkondensator 0603]
C72  1µF  [SMD Keramikkondensator 0603]
C73  1µF  [SMD Keramikkondensator 0603]
C74  1µF  [SMD Keramikkondensator 0603]
C75  1µF  [SMD Keramikkondensator 0603]
C76  1µF  [SMD Keramikkondensator 0603]
C77  1µF  [SMD Keramikkondensator 0603]
C78  1µF  [SMD Keramikkondensator 0603]
C79  1µF  [SMD Keramikkondensator 0603]
C80  1µF  [SMD Keramikkondensator 0603]
C81  1µF  [SMD Keramikkondensator 0603]
C82  1µF  [SMD Keramikkondensator 0603]
C83  1µF  [SMD Keramikkondensator 0603]
C84  1µF  [SMD Keramikkondensator 0603]
C85  1µF  [SMD Keramikkondensator 0603]
C86  1µF  [SMD Keramikkondensator 0603]
C87  1µF  [SMD Keramikkondensator 0603]
C88  1µF  [SMD Keramikkondensator 0603]
C89  1µF  [SMD Keramikkondensator 0603]
C90  1µF  [SMD Keramikkondensator 0603]
C91  1µF  [SMD Keramikkondensator 0603]
C92  1µF  [SMD Keramikkondensator 0603]
C93  1µF  [SMD Keramikkondensator 0603]
C94  10µF  [SMD Keramikkondensator 1206]
P2  APA102C  [SMD LED APA102C-5050]
P3  APA102C  [SMD LED APA102C-5050]
P4  APA102C  [SMD LED APA102C-5050]
P5  APA102C  [SMD LED APA102C-5050]
P6  APA102C  [SMD LED APA102C-5050]
P7  APA102C  [SMD LED APA102C-5050]
P8  APA102C  [SMD LED APA102C-5050]
P9  APA102C  [SMD LED APA102C-5050]
P10  APA102C  [SMD LED APA102C-5050]
P11  APA102C  [SMD LED APA102C-5050]
P12  APA102C  [SMD LED APA102C-5050]
P13  APA102C  [SMD LED APA102C-5050]
P14  APA102C  [SMD LED APA102C-5050]
P15  APA102C  [SMD LED APA102C-5050]
P16  APA102C  [SMD LED APA102C-5050]
P17  APA102C  [SMD LED APA102C-5050]
P18  APA102C  [SMD LED APA102C-5050]
P19  APA102C  [SMD LED APA102C-5050]
P20  APA102C  [SMD LED APA102C-5050]
P21  APA102C  [SMD LED APA102C-5050]
P22  APA102C  [SMD LED APA102C-5050]
P23  APA102C  [SMD LED APA102C-5050]
P24  APA102C  [SMD LED APA102C-5050]
P25  APA102C  [SMD LED APA102C-5050]
P26  APA102C  [SMD LED APA102C-5050]
P27  APA102C  [SMD LED APA102C-5050]
P28  APA102C  [SMD LED APA102C-5050]
P29  APA102C  [SMD LED APA102C-5050]
P30  APA102C  [SMD LED APA102C-5050]
P31  APA102C  [SMD LED APA102C-5050]
P32  APA102C  [SMD LED APA102C-5050]
P33  APA102C  [SMD LED APA102C-5050]
P34  APA102C  [SMD LED APA102C-5050]
P35  APA102C  [SMD LED APA102C-5050]
P36  APA102C  [SMD LED APA102C-5050]
P37  APA102C  [SMD LED APA102C-5050]
P38  APA102C  [SMD LED APA102C-5050]
P39  APA102C  [SMD LED APA102C-5050]
R43  10k  [SMD Widerstand 0603]
R44  10k  [SMD Widerstand 0603]
U12  SN74LVC3G17  [SMD IC SM-8]
X17  Board-To-Wire Connector (Receptacle)  [THT Connector 2.5mm 4-Pol (1778641)]  (value not drawn)

### Ports
SPI_LED (harness SPI_LED)

### Harnesses
SPI_LED: SCLK, MOSI

### Nets
5V: C55.2 C56.2 C57.2 C58.2 C59.2 C60.2 C61.2 C62.2 C63.2 C64.2 C65.2 C66.2 C67.2 C68.2 C69.2 C70.2 C71.2 C72.2 C73.2 C74.2 C75.2 C76.2 C77.2 C78.2 C79.2 C80.2 C81.2 C82.2 C83.2 C84.2 C85.2 C86.2 C87.2 C88.2 C89.2 C90.2 C91.2 C92.2 C93.2 C94.2 P2.4(VCC) P3.4(VCC) P4.4(VCC) P5.4(VCC) P6.4(VCC) P7.4(VCC) P8.4(VCC) P9.4(VCC) P10.4(VCC) P11.4(VCC) P12.4(VCC) P13.4(VCC) P14.4(VCC) P15.4(VCC) P16.4(VCC) P17.4(VCC) P18.4(VCC) P19.4(VCC) P20.4(VCC) P21.4(VCC) P22.4(VCC) P23.4(VCC) P24.4(VCC) P25.4(VCC) P26.4(VCC) P27.4(VCC) P28.4(VCC) P29.4(VCC) P30.4(VCC) P31.4(VCC) P32.4(VCC) P33.4(VCC) P34.4(VCC) P35.4(VCC) P36.4(VCC) P37.4(VCC) P38.4(VCC) P39.4(VCC) U12.8(VCC) X17.4
GND: C55.1 C56.1 C57.1 C58.1 C59.1 C60.1 C61.1 C62.1 C63.1 C64.1 C65.1 C66.1 C67.1 C68.1 C69.1 C70.1 C71.1 C72.1 C73.1 C74.1 C75.1 C76.1 C77.1 C78.1 C79.1 C80.1 C81.1 C82.1 C83.1 C84.1 C85.1 C86.1 C87.1 C88.1 C89.1 C90.1 C91.1 C92.1 C93.1 C94.1 P2.3(GND) P3.3(GND) P4.3(GND) P5.3(GND) P6.3(GND) P7.3(GND) P8.3(GND) P9.3(GND) P10.3(GND) P11.3(GND) P12.3(GND) P13.3(GND) P14.3(GND) P15.3(GND) P16.3(GND) P17.3(GND) P18.3(GND) P19.3(GND) P20.3(GND) P21.3(GND) P22.3(GND) P23.3(GND) P24.3(GND) P25.3(GND) P26.3(GND) P27.3(GND) P28.3(GND) P29.3(GND) P30.3(GND) P31.3(GND) P32.3(GND) P33.3(GND) P34.3(GND) P35.3(GND) P36.3(GND) P37.3(GND) P38.3(GND) P39.3(GND) R43.1 R44.1 U12.4(GND) U12.6(A3) X17.1  [project net A14]
SPI5_MOSI: R44.2 U12.3(A2) ; port SPI_LED.MOSI
SPI5_SCLK: R43.2 U12.1(A1) ; port SPI_LED.SCLK
NetP2_1: P2.1(DI) U12.5(Y2)
NetP2_2: P2.2(CI) U12.7(Y1)
NetP2_5: P2.5(CO) P3.2(CI)
NetP2_6: P2.6(DO) P3.1(DI)
NetP3_5: P3.5(CO) P4.2(CI)
NetP3_6: P3.6(DO) P4.1(DI)
NetP4_5: P4.5(CO) P5.2(CI)
NetP4_6: P4.6(DO) P5.1(DI)
NetP5_5: P5.5(CO) P6.2(CI)
NetP5_6: P5.6(DO) P6.1(DI)
NetP6_5: P6.5(CO) P7.2(CI)
NetP6_6: P6.6(DO) P7.1(DI)
NetP7_5: P7.5(CO) P8.2(CI)
NetP7_6: P7.6(DO) P8.1(DI)
NetP8_5: P8.5(CO) P9.2(CI)
NetP8_6: P8.6(DO) P9.1(DI)
NetP9_5: P9.5(CO) P10.2(CI)
NetP9_6: P9.6(DO) P10.1(DI)
NetP10_5: P10.5(CO) P11.2(CI)
NetP10_6: P10.6(DO) P11.1(DI)
NetP11_5: P11.5(CO) P12.2(CI)
NetP11_6: P11.6(DO) P12.1(DI)
NetP12_5: P12.5(CO) P13.2(CI)
NetP12_6: P12.6(DO) P13.1(DI)
NetP13_5: P13.5(CO) P14.2(CI)
NetP13_6: P13.6(DO) P14.1(DI)
NetP14_5: P14.5(CO) P15.2(CI)
NetP14_6: P14.6(DO) P15.1(DI)
NetP15_5: P15.5(CO) P16.2(CI)
NetP15_6: P15.6(DO) P16.1(DI)
NetP16_5: P16.5(CO) P17.2(CI)
NetP16_6: P16.6(DO) P17.1(DI)
NetP17_5: P17.5(CO) P18.2(CI)
NetP17_6: P17.6(DO) P18.1(DI)
NetP18_5: P18.5(CO) P19.2(CI)
NetP18_6: P18.6(DO) P19.1(DI)
NetP19_5: P19.5(CO) P20.2(CI)
NetP19_6: P19.6(DO) P20.1(DI)
NetP20_5: P20.5(CO) P21.2(CI)
NetP20_6: P20.6(DO) P21.1(DI)
NetP21_5: P21.5(CO) P22.2(CI)
NetP21_6: P21.6(DO) P22.1(DI)
NetP22_5: P22.5(CO) P23.2(CI)
NetP22_6: P22.6(DO) P23.1(DI)
NetP23_5: P23.5(CO) P24.2(CI)
NetP23_6: P23.6(DO) P24.1(DI)
NetP24_5: P24.5(CO) P25.2(CI)
NetP24_6: P24.6(DO) P25.1(DI)
NetP25_5: P25.5(CO) P26.2(CI)
NetP25_6: P25.6(DO) P26.1(DI)
NetP26_5: P26.5(CO) P27.2(CI)
NetP26_6: P26.6(DO) P27.1(DI)
NetP27_5: P27.5(CO) P28.2(CI)
NetP27_6: P27.6(DO) P28.1(DI)
NetP28_5: P28.5(CO) P29.2(CI)
NetP28_6: P28.6(DO) P29.1(DI)
NetP29_5: P29.5(CO) P30.2(CI)
NetP29_6: P29.6(DO) P30.1(DI)
NetP30_5: P30.5(CO) P31.2(CI)
NetP30_6: P30.6(DO) P31.1(DI)
NetP31_5: P31.5(CO) P32.2(CI)
NetP31_6: P31.6(DO) P32.1(DI)
NetP32_5: P32.5(CO) P33.2(CI)
NetP32_6: P32.6(DO) P33.1(DI)
NetP33_5: P33.5(CO) P34.2(CI)
NetP33_6: P33.6(DO) P34.1(DI)
NetP34_5: P34.5(CO) P35.2(CI)
NetP34_6: P34.6(DO) P35.1(DI)
NetP35_5: P35.5(CO) P36.2(CI)
NetP35_6: P35.6(DO) P36.1(DI)
NetP36_5: P36.5(CO) P37.2(CI)
NetP36_6: P36.6(DO) P37.1(DI)
NetP37_5: P37.5(CO) P38.2(CI)
NetP37_6: P37.6(DO) P38.1(DI)
NetP38_5: P38.5(CO) P39.2(CI)
NetP38_6: P38.6(DO) P39.1(DI)
NetP39_5: P39.5(CO) X17.3
NetP39_6: P39.6(DO) X17.2

Not connected (* = marked no-connect by the designer): U12 2(Y3)*

### Notes on the sheet
- Schmitt-Trigger Buffer
- (near U12) Level-Shifter
- LED Ring:
  Sparkfun (COM-14967)
  APA102C (20 LEDs, 25.4 mm)
- Matching Connector:
  Phoenix Contact (1778858)
- Title
- Author:
- Subtitle
- Date:
- Rev:
- File:
- Sheet
- of

### Library data of the parts
C55-C93 = C-CAPACITOR: as C26 on sheet Audio-Beamformer_Driver_V1.0; Digikey: 1276-1860-1-ND; Farnell: 3013383; Mouser: 187-CL10A105KB8NNNC; JLC-Parts: C15849; Unit Price: 0.01
C94 = C-CAPACITOR: as C2 on sheet Audio-Beamformer_Supply_V1.0; Digikey: 445-7886-1-ND; Farnell: 2211092; Mouser: 810-CGA5L3X5R1H106K; JLC-Parts: C13585; Unit Price: 0.27
P2-P39 = P-APA102C: Smart RGB-LED; Digikey: 1568-COM-16345-ND; Mouser: 474-COM-16345; ComponentLink1Description: Datasheet; ComponentLink1URL: https://cdn.sparkfun.com/datasheets/Components/LED/APA102C.pdf; Component Description: Smart RGB-LED; Component Value: APA102C; Unit Price: 0.35
R43 R44 = R-RESISTOR: as R21 on sheet Audio-Beamformer_Driver_V1.0; Digikey: P10.0KHCT-ND; Farnell: 2303192; Mouser: 667-ERJ-3EKF1002V; JLC-Parts: C25804; Unit Price: 0.01
U12 = U-SN74LVC3G17DCTR: Tripple Schmitt-Trigger Buffer; Digikey: 296-16915-1-ND; Farnell: 595-SN74LVC3G17DCTR; Mouser: 595-SN74LVC3G17DCTR; Component Description: Tripple Schmitt-Trigger Buffer; ComponentLink1Description: Datasheet; ComponentLink1URL: https://datasheet.lcsc.com/lcsc/1809081631_Texas-Instruments-SN74LVC3G17DCTR_C18213.pdf; Component Value: SN74LVC3G17DCTR; JLC-Parts: C18213; Unit Price: 0.70
X17 = X-Stiftleiste (4-Fach): Component Value: PTSM 0,5/ 4-HH-2,5-THR R32; Digikey: 277-2310-1-ND; Farnell: 3240558; Mouser: 651-1778641; Component Description: Board-To-Wire Connector (Receptacle); ComponentLink1Description: Datasheet; ComponentLink1URL: https://4donline.ihs.com/images/VipMasterIC/IC/PCON/PCONS21961/PCONS22028-1.pdf?hkey=52A5661711E402568146F3353EA87419; Unit Price: 0.74

## Sheet Audio-Beamformer_RaspberryPi_V1.0.SchDoc: Audio-Beamformer
size A4; PageSetup: Record=PageOptions|CenterHorizontal=True|CenterVertical=True|PrintScale=0.97|XCorrection=1.00|YCorrection=1.00|PrintKind=0|BorderSize=5000000|LeftOffset=0|BottomOffset=0|Orientation=2|PaperLength=1000|PaperWidth=1000|Scale=100|PaperSource=7|PrintQuality=-3|MediaType=1|DitherType=10|PrintScaleMode=1|PaperKind=A4|PaperIndex=9; Organization: Ostschweizer Fachhochschule; Address2: Florian Baumgartner & Thierry Schwaller; Address3: florian.baumgartner@ost.ch; DocumentNumber: 3; Revision: V1.0; SheetNumber: 3; SheetTotal: 10; Author: Florian Baumgartner & Thierry Schwaller; Subtitle: Raspberry Pi Compute Module 4
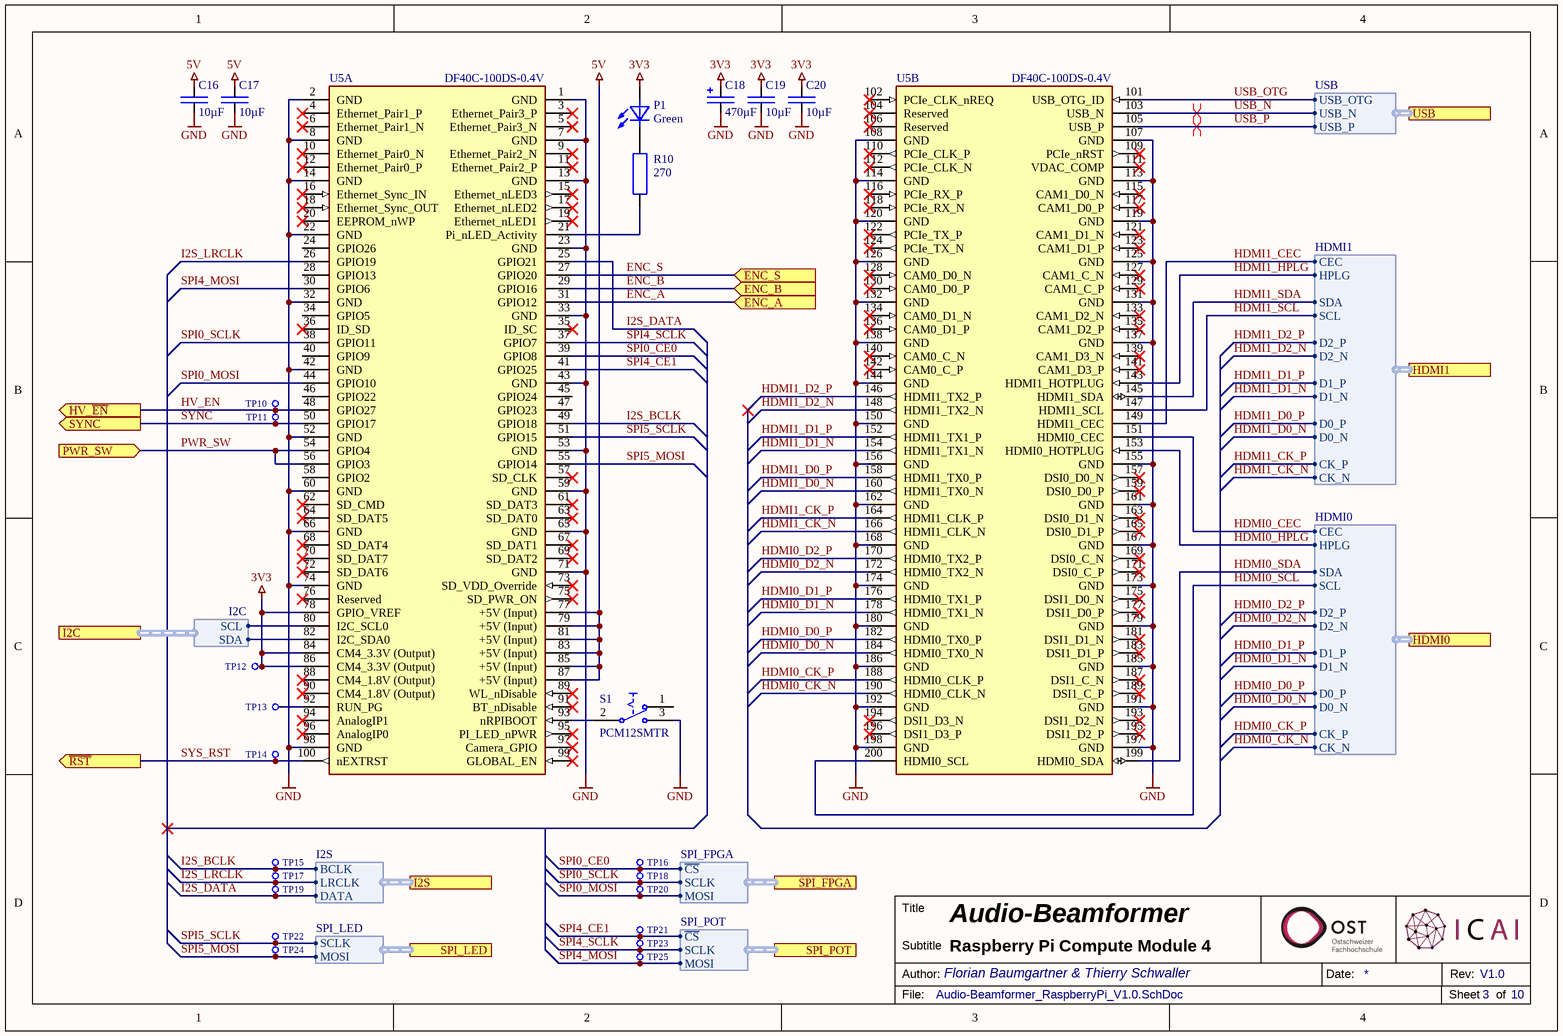
[diagram p4: Audio-Beamformer_RaspberryPi_V1.0.SchDoc]

### Parts
C16  10µF  [SMD Keramikkondensator 1206]
C17  10µF  [SMD Keramikkondensator 1206]
C18  470µF  [SMD Elko 10.0x10.0]
C19  10µF  [SMD Keramikkondensator 1206]
C20  10µF  [SMD Keramikkondensator 1206]
P1  Green  [SMD LED 0603]
R10  270  [SMD Widerstand 0603]
S1  PCM12SMTR  [SMD Switch SPDT (PCM12SMTR)]
TP10  X-TP  [THT Testpunkt Ø1mm]  (value not drawn)  (no BOM)
TP11  X-TP  [THT Testpunkt Ø1mm]  (value not drawn)  (no BOM)
TP12  X-TP  [THT Testpunkt Ø1mm]  (value not drawn)  (no BOM)
TP13  X-TP  [THT Testpunkt Ø1mm]  (value not drawn)  (no BOM)
TP14  X-TP  [THT Testpunkt Ø1mm]  (value not drawn)  (no BOM)
TP15  X-TP  [THT Testpunkt Ø1mm]  (value not drawn)  (no BOM)
TP16  X-TP  [THT Testpunkt Ø1mm]  (value not drawn)  (no BOM)
TP17  X-TP  [THT Testpunkt Ø1mm]  (value not drawn)  (no BOM)
TP18  X-TP  [THT Testpunkt Ø1mm]  (value not drawn)  (no BOM)
TP19  X-TP  [THT Testpunkt Ø1mm]  (value not drawn)  (no BOM)
TP20  X-TP  [THT Testpunkt Ø1mm]  (value not drawn)  (no BOM)
TP21  X-TP  [THT Testpunkt Ø1mm]  (value not drawn)  (no BOM)
TP22  X-TP  [THT Testpunkt Ø1mm]  (value not drawn)  (no BOM)
TP23  X-TP  [THT Testpunkt Ø1mm]  (value not drawn)  (no BOM)
TP24  X-TP  [THT Testpunkt Ø1mm]  (value not drawn)  (no BOM)
TP25  X-TP  [THT Testpunkt Ø1mm]  (value not drawn)  (no BOM)
U5  DF40C-100DS-0.4V  [SMD CM4-F40C-100DS-0.4v_1.5mm]  (parts A,B of 2)

### Ports
ENC_A (in), ENC_B (in), ENC_S (in), HDMI0 (harness HDMI0), HDMI1 (harness HDMI1), HV_~{EN} (out), I2C (harness I2C), I2S (harness I2S), PWR_SW (in), SPI_FPGA (harness SPI_FPGA), SPI_LED (harness SPI_LED), SPI_POT (harness SPI_POT), SYNC (out), USB (harness USB), ~{RST} (out)

### Harnesses
USB: USB_N, USB_P, USB_OTG
HDMI0: D2_N, D1_P, D2_P, D1_N, D0_P, D0_N, CK_N, CK_P, CEC, SCL, SDA, HPLG
HDMI1: D2_N, D1_P, D2_P, D1_N, D0_P, D0_N, CK_N, CK_P, CEC, SCL, SDA, HPLG
I2C: SCL, SDA
SPI_LED: SCLK, MOSI
I2S: BCLK, LRCLK, DATA
SPI_FPGA: SCLK, MOSI, ~{CS}
SPI_POT: SCLK, MOSI, ~{CS}

### Nets
3V3: C18.P(+) C19.2 C20.2 P1.A TP12.1 U5.78(GPIO_VREF) U5.84(CM4_3.3V_(Output)) U5.86(CM4_3.3V_(Output))  [project net A17]
5V: C16.2 C17.2 U5.77(+5V_(Input)) U5.79(+5V_(Input)) U5.81(+5V_(Input)) U5.83(+5V_(Input)) U5.85(+5V_(Input)) U5.87(+5V_(Input))
GND: C16.1 C17.1 C18.M(-) C19.1 C20.1 S1.3(NO1) U5.1(GND) U5.2(GND) U5.7(GND) U5.8(GND) U5.13(GND) U5.14(GND) U5.22(GND) U5.23(GND) U5.32(GND) U5.33(GND) U5.42(GND) U5.43(GND) U5.52(GND) U5.53(GND) U5.59(GND) U5.60(GND) U5.65(GND) U5.66(GND) U5.71(GND) U5.74(GND) U5.98(GND) U5.107(GND) U5.108(GND) U5.113(GND) U5.114(GND) U5.119(GND) U5.120(GND) U5.125(GND) U5.126(GND) U5.131(GND) U5.132(GND) U5.137(GND) U5.138(GND) U5.144(GND) U5.150(GND) U5.155(GND) U5.156(GND) U5.161(GND) U5.162(GND) U5.167(GND) U5.168(GND) U5.173(GND) U5.174(GND) U5.179(GND) U5.180(GND) U5.185(GND) U5.186(GND) U5.191(GND) U5.192(GND) U5.197(GND) U5.198(GND)  [project net A14]
ENC_A: U5.31(GPIO12) ; port ENC_A
ENC_B: U5.29(GPIO16) ; port ENC_B
ENC_S: U5.27(GPIO20) ; port ENC_S
HDMI0_CEC: U5.151(HDMI0_CEC) ; port HDMI0.CEC
HDMI0_CK_N: U5.190(HDMI0_CLK_N) ; port HDMI0.CK_N
HDMI0_CK_P: U5.188(HDMI0_CLK_P) ; port HDMI0.CK_P
HDMI0_D0_N: U5.184(HDMI0_TX0_N) ; port HDMI0.D0_N
HDMI0_D0_P: U5.182(HDMI0_TX0_P) ; port HDMI0.D0_P
HDMI0_D1_N: U5.178(HDMI0_TX1_N) ; port HDMI0.D1_N
HDMI0_D1_P: U5.176(HDMI0_TX1_P) ; port HDMI0.D1_P
HDMI0_D2_N: U5.172(HDMI0_TX2_N) ; port HDMI0.D2_N
HDMI0_D2_P: U5.170(HDMI0_TX2_P) ; port HDMI0.D2_P
HDMI0_HPLG: U5.153(HDMI0_HOTPLUG) ; port HDMI0.HPLG
HDMI0_SCL: U5.200(HDMI0_SCL) ; port HDMI0.SCL
HDMI0_SDA: U5.199(HDMI0_SDA) ; port HDMI0.SDA
HDMI1_CEC: U5.149(HDMI1_CEC) ; port HDMI1.CEC
HDMI1_CK_N: U5.166(HDMI1_CLK_N) ; port HDMI1.CK_N
HDMI1_CK_P: U5.164(HDMI1_CLK_P) ; port HDMI1.CK_P
HDMI1_D0_N: U5.160(HDMI1_TX0_N) ; port HDMI1.D0_N
HDMI1_D0_P: U5.158(HDMI1_TX0_P) ; port HDMI1.D0_P
HDMI1_D1_N: U5.154(HDMI1_TX1_N) ; port HDMI1.D1_N
HDMI1_D1_P: U5.152(HDMI1_TX1_P) ; port HDMI1.D1_P
HDMI1_D2_N: U5.148(HDMI1_TX2_N) ; port HDMI1.D2_N
HDMI1_D2_P: U5.146(HDMI1_TX2_P) ; port HDMI1.D2_P
HDMI1_HPLG: U5.143(HDMI1_HOTPLUG) ; port HDMI1.HPLG
HDMI1_SCL: U5.147(HDMI1_SCL) ; port HDMI1.SCL
HDMI1_SDA: U5.145(HDMI1_SDA) ; port HDMI1.SDA
HV_EN: TP10.1 U5.48(GPIO27) ; port HV_~{EN}
I2S_BCLK: TP15.1 U5.49(GPIO18) ; port I2S.BCLK  [project net A2]
I2S_DATA: TP19.1 U5.25(GPIO21) ; port I2S.DATA  [project net A5]
I2S_LRCLK: TP17.1 U5.26(GPIO19) ; port I2S.LRCLK  [project net A3]
PWR_SW: U5.54(GPIO4) U5.56(GPIO3) ; port PWR_SW
SPI0_CE0: TP16.1 U5.39(GPIO8) ; port SPI_FPGA.~{CS}  [project net A6]
SPI0_MOSI: TP20.1 U5.44(GPIO10) ; port SPI_FPGA.MOSI  [project net A9]
SPI0_SCLK: TP18.1 U5.38(GPIO11) ; port SPI_FPGA.SCLK  [project net A8]
SPI4_CE1: TP21.1 U5.41(GPIO25) ; port SPI_POT.~{CS}
SPI4_MOSI: TP25.1 U5.30(GPIO6) ; port SPI_POT.MOSI
SPI4_SCLK: TP23.1 U5.37(GPIO7) ; port SPI_POT.SCLK
SPI5_MOSI: TP24.1 U5.55(GPIO14) ; port SPI_LED.MOSI
SPI5_SCLK: TP22.1 U5.51(GPIO15) ; port SPI_LED.SCLK
SYNC: TP11.1 U5.50(GPIO17) ; port SYNC  [project net A12]
SYS_RST: TP14.1 U5.100(nEXTRST) ; port ~{RST}  [project net D39]
USB_N: U5.103(USB_N) ; port USB.USB_N
USB_OTG: U5.101(USB_OTG_ID) ; port USB.USB_OTG
USB_P: U5.105(USB_P) ; port USB.USB_P
NetP1_K: P1.K R10.1
NetR10_2: R10.2 U5.21(Pi_nLED_Activity)
NetS1_2: S1.2(COMMON1) U5.93(nRPIBOOT)
NetTP13_1: TP13.1 U5.92(RUN_PG)
NetU5_80: U5.80(I2C_SCL0) ; port I2C.SCL
NetU5_82: U5.82(I2C_SDA0) ; port I2C.SDA

Not connected (* = marked no-connect by the designer): S1 1(NC1); U5 3(Ethernet_Pair3_P)* 4(Ethernet_Pair1_P)* 5(Ethernet_Pair3_N)* 6(Ethernet_Pair1_N)* 9(Ethernet_Pair2_N)* 10(Ethernet_Pair0_N)* 11(Ethernet_Pair2_P)* 12(Ethernet_Pair0_P)* 15(Ethernet_nLED3)* 16(Ethernet_Sync_IN)* 17(Ethernet_nLED2)* 18(Ethernet_Sync_OUT)* 19(Ethernet_nLED1)* 20(EEPROM_nWP)* 24(GPIO26) 28(GPIO13) 34(GPIO5) 35(ID_SC)* 36(ID_SD)* 40(GPIO9) 45(GPIO24) 46(GPIO22) 47(GPIO23) 57(SD_CLK)* 58(GPIO2) 61(SD_DAT3)* 62(SD_CMD)* 63(SD_DAT0)* 64(SD_DAT5)* 67(SD_DAT1)* 68(SD_DAT4)* 69(SD_DAT2)* 70(SD_DAT7)* 72(SD_DAT6)* 73(SD_VDD_Override)* 75(SD_PWR_ON)* 76(Reserved)* 88(CM4_1.8V_(Output))* 89(WL_nDisable)* 90(CM4_1.8V_(Output))* 91(BT_nDisable)* 94(AnalogIP1)* 95(PI_LED_nPWR)* 96(AnalogIP0)* 97(Camera_GPIO)* 99(GLOBAL_EN)* 102(PCIe_CLK_nREQ)* 104(Reserved)* 106(Reserved)* 109(PCIe_nRST)* 110(PCIe_CLK_P)* 111(VDAC_COMP)* 112(PCIe_CLK_N)* 115(CAM1_D0_N)* 116(PCIe_RX_P)* 117(CAM1_D0_P)* 118(PCIe_RX_N)* 121(CAM1_D1_N)* 122(PCIe_TX_P)* 123(CAM1_D1_P)* 124(PCIe_TX_N)* 127(CAM1_C_N)* 128(CAM0_D0_N)* 129(CAM1_C_P)* 130(CAM0_D0_P)* 133(CAM1_D2_N)* 134(CAM0_D1_N)* 135(CAM1_D2_P)* 136(CAM0_D1_P)* 139(CAM1_D3_N)* 140(CAM0_C_N)* 141(CAM1_D3_P)* 142(CAM0_C_P)* 157(DSI0_D0_N)* 159(DSI0_D0_P)* 163(DSI0_D1_N)* 165(DSI0_D1_P)* 169(DSI0_C_N)* 171(DSI0_C_P)* 175(DSI1_D0_N)* 177(DSI1_D0_P)* 181(DSI1_D1_N)* 183(DSI1_D1_P)* 187(DSI1_C_N)* 189(DSI1_C_P)* 193(DSI1_D2_N)* 194(DSI1_D3_N)* 195(DSI1_D2_P)* 196(DSI1_D3_P)*

### Layout directives
differential pair: USB_N, USB_P

### Notes on the sheet
- Title
- Author:
- Subtitle
- Date:
- Rev:
- File:
- Sheet
- of

### Library data of the parts
C16 C17 C19 C20 = C-CAPACITOR: as C2 on sheet Audio-Beamformer_Supply_V1.0; Digikey: 445-7886-1-ND; Farnell: 2211092; Mouser: 810-CGA5L3X5R1H106K; JLC-Parts: C13585; Unit Price: 0.27
C18 = C-ELCAP: as C3 on sheet Audio-Beamformer_Supply_V1.0; Mouser: 140-VEJ471M1ETR1010; JLC-Parts: C176672; Unit Price: 0.17
P1 = LED Green 0603: General Purpose LED; Component Value: Green (5mA, 2.4V); Digikey: 350-2035-1-ND; Farnell: 1465991; Mouser: 645-598-8070-107F; Unit Price: 0.34; ComponentLink1Description: Datasheet; ComponentLink1URL: https://datasheet.lcsc.com/szlcsc/Everlight-Elec-19-217-GHC-YR1S2-3T_C72043.pdf; JLC-Parts: C72043; Component Description: General Purpose LED
R10 = R-RESISTOR: as R12 on sheet Audio-Beamformer_Driver_V1.0; Digikey: P270HCT-ND; Farnell: 2303096; Mouser: 667-ERJ-3EKF2700V; JLC-Parts: C22966; Unit Price: 0.06
S1 = S-PCM12SMTR: Miniature Slide Switch; aliExpress: 33002042977; Component Value: PCM12SMTR (SPDT); Digikey: 401-2016-1-ND; Mouser: 611-PCM12SMTR; Farnell: 9575146; JLC-Parts: C221841; Component Description: Miniature Slide Switch; Unit Price: 0.77
TP10-TP25 = X-TP: as TP1 on sheet Audio-Beamformer_V1.0; Unit Price: 0.00
U5 = U-CM4: Board-To-Board Connector; ComponentLink1Description: Datasheet; ComponentLink1URL: https://www.farnell.com/datasheets/2691051.pdf; Digikey: H11615CT-ND; Component Value: DF40C-100DS-0.4V; Farnell: 2427679; JLC-Parts: C597931; Mouser: 798-DF40C100DS0.4V51; Unit Price: 1.59; Component Description: Board-To-Board Connector